# Altium project QuadcopterDesign.PrjPcb (part 2 of 4)

## Sheet [2] MicroController.SchDoc
size A4; Organization: UNMEI ELECTRICAL; Address1: 16B/12 Nguyen Du Street; Address2: Da Lat City, LD Province; SheetNumber: 2; SheetTotal: 7
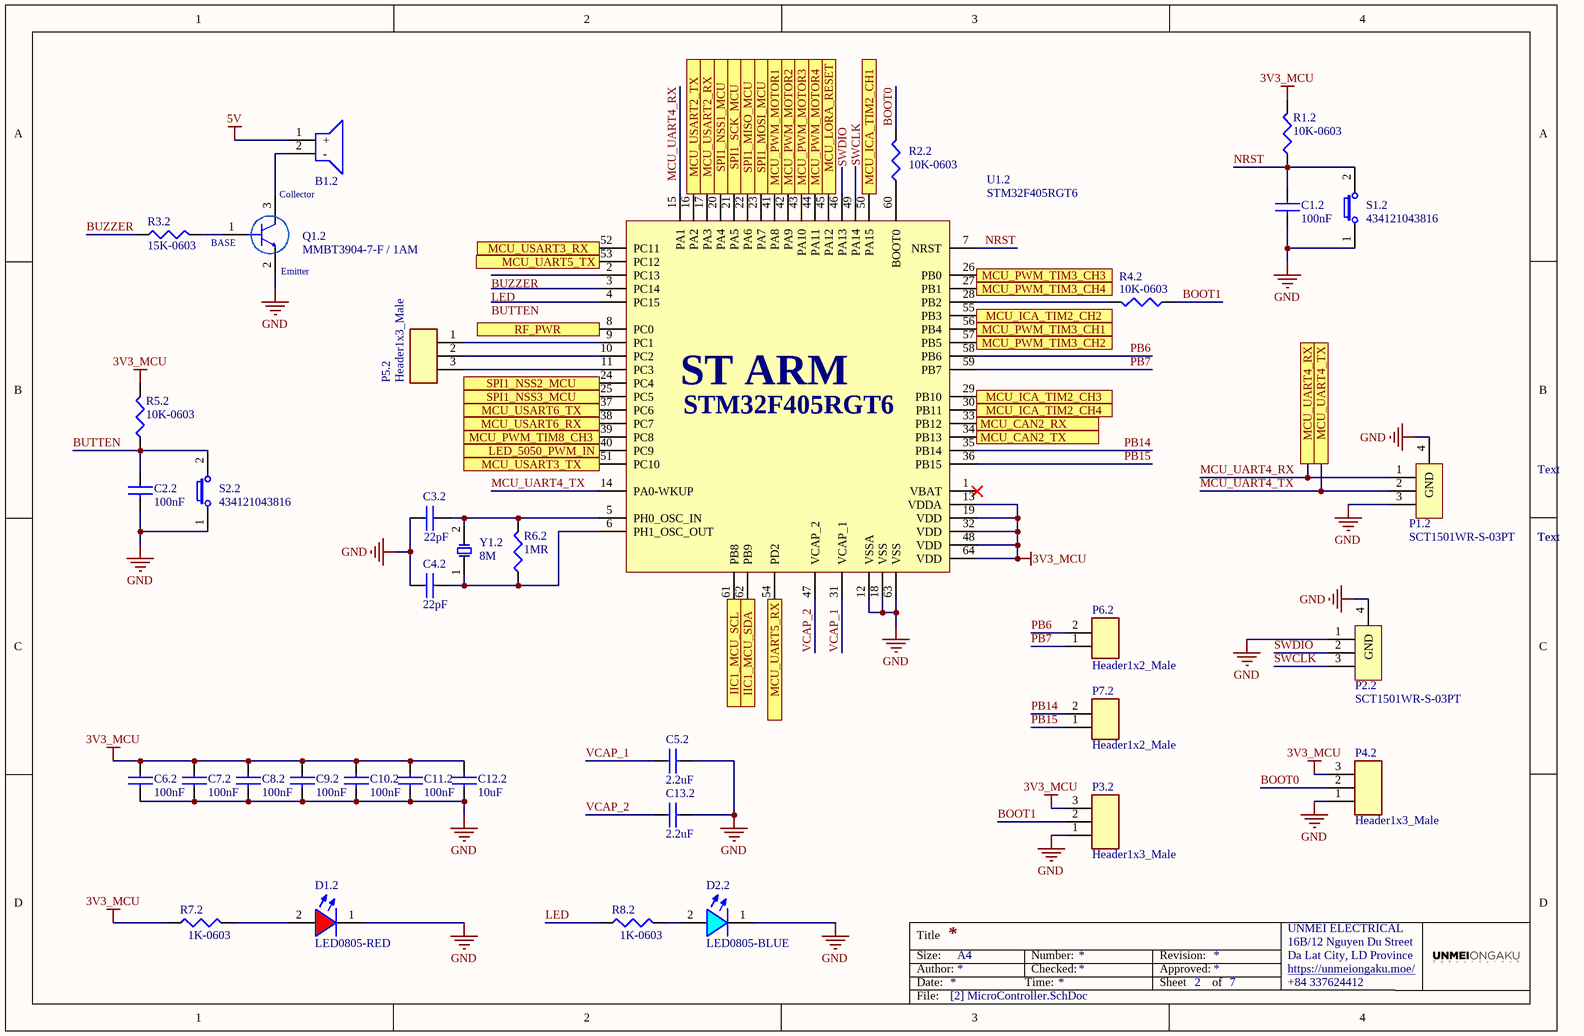
[diagram p1: [2] MicroController.SchDoc]

### Parts
B1.2  Buzzer  [Buzzer 9x5mm 60dB]  (value not drawn)
C1.2  100nF  [CAP0603]
C2.2  100nF  [CAP0603]
C3.2  22pF  [CAP0603]
C4.2  22pF  [CAP0603]
C5.2  2.2uF  [CAP0603]
C6.2  100nF  [CAP0603]
C7.2  100nF  [CAP0603]
C8.2  100nF  [CAP0603]
C9.2  100nF  [CAP0603]
C10.2  100nF  [CAP0603]
C11.2  100nF  [CAP0603]
C12.2  10uF  [CAP0603]
C13.2  2.2uF  [CAP0603]
D1.2  LED0805-RED  [LED0805-RED]
D2.2  LED0805-BLUE  [LED0805-BLUE]
P1.2  SCT1501WR-S-03PT  [Connector ZH1.5 3P SMD]
P2.2  SCT1501WR-S-03PT  [Connector ZH1.5 3P SMD]
P3.2  Header1x3_Male  [HDR1x3_2.54_MALE]
P4.2  Header1x3_Male  [HDR1x3_2.54_MALE]
P5.2  Header1x3_Male  [HDR1x3_2.54_MALE]
P6.2  Header1x2_Male  [HDR1x2_2.54_MALE]
P7.2  Header1x2_Male  [HDR1x2_2.54_MALE]
Q1.2  MMBT3904-7-F / 1AM  [SOT23]
R1.2  10K-0603  [RES0603 - 3D]
R2.2  10K-0603  [RES0603 - 3D]
R3.2  15K-0603  [RES0603 - 3D]
R4.2  10K-0603  [RES0603 - 3D]
R5.2  10K-0603  [RES0603 - 3D]
R6.2  1MR  [RES0603 - 3D]
R7.2  1K-0603  [RES0603 - 3D]
R8.2  1K-0603  [RES0603 - 3D]
S1.2  434121043816  [Switches-6x3.5x4.3mm]
S2.2  434121043816  [Switches-6x3.5x4.3mm]
U1.2  STM32F405RGT6  [LQFP64]
Y1.2  8M  [HC49-S]

### Ports
IIC1_MCU_SCL, IIC1_MCU_SDA, LED_5050_PWM_IN, MCU_CAN2_RX, MCU_CAN2_TX, MCU_ICA_TIM2_CH1, MCU_ICA_TIM2_CH2, MCU_ICA_TIM2_CH3, MCU_ICA_TIM2_CH4, MCU_LORA_RESET, MCU_PWM_MOTOR1, MCU_PWM_MOTOR2, MCU_PWM_MOTOR3, MCU_PWM_MOTOR4, MCU_PWM_TIM3_CH1, MCU_PWM_TIM3_CH2, MCU_PWM_TIM3_CH3, MCU_PWM_TIM3_CH4, MCU_PWM_TIM8_CH3, MCU_UART4_RX, MCU_UART4_TX, MCU_UART5_RX, MCU_UART5_TX, MCU_USART2_RX, MCU_USART2_TX, MCU_USART3_RX, MCU_USART3_TX, MCU_USART6_RX, MCU_USART6_TX, RF_PWR, SPI1_MISO_MCU, SPI1_MOSI_MCU, SPI1_NSS1_MCU, SPI1_NSS2_MCU, SPI1_NSS3_MCU, SPI1_SCK_MCU

### Nets
3V3_MCU: C6.2.1 C7.2.1 C8.2.1 C9.2.1 C10.2.1 C11.2.1 C12.2.1 P3.2.3 P4.2.3 R1.2.2 R5.2.2 R7.2.1 U1.2.13(VDDA) U1.2.19(VDD) U1.2.32(VDD) U1.2.48(VDD) U1.2.64(VDD)  [project net 3V3_MC]
5V: B1.2.1(+)
GND: C1.2.2 C2.2.2 C3.2.1 C4.2.1 C5.2.2 C6.2.2 C7.2.2 C8.2.2 C9.2.2 C10.2.2 C11.2.2 C12.2.2 C13.2.2 D1.2.1(+) D2.2.1(+) P1.2.3 P1.2.4(GND) P2.2.1 P2.2.4(GND) P3.2.1 P4.2.1 Q1.2.2 S1.2.1 S2.2.1 U1.2.12(VSSA) U1.2.18(VSS) U1.2.63(VSS)
BOOT0: P4.2.2 R2.2.2
BOOT1: P3.2.2 R4.2.1
BUTTEN: C2.2.1 R5.2.1 S2.2.2 U1.2.4(PC15)
BUZZER: R3.2.1 U1.2.2(PC13)
LED: R8.2.1 U1.2.3(PC14)
MCU_UART4_RX: P1.2.1 U1.2.15(PA1) ; port MCU_UART4_RX
MCU_UART4_TX: P1.2.2 U1.2.14(PA0-WKUP) ; port MCU_UART4_TX
NRST: C1.2.1 R1.2.1 S1.2.2 U1.2.7(NRST)
PB6: P6.2.2 U1.2.58(PB6)
PB7: P6.2.1 U1.2.59(PB7)
PB14: P7.2.2 U1.2.35(PB14)
PB15: P7.2.1 U1.2.36(PB15)
SWCLK: P2.2.3 U1.2.49(PA14)
SWDIO: P2.2.2 U1.2.46(PA13)
VCAP_1: C5.2.1 U1.2.31(VCAP_1)
VCAP_2: C13.2.1 U1.2.47(VCAP_2)
NetB1.2_2: B1.2.2(-) Q1.2.3
NetC3.2_2: C3.2.2 R6.2.2 U1.2.5(PH0_OSC_IN) Y1.2.2
NetC4.2_2: C4.2.2 R6.2.1 U1.2.6(PH1_OSC_OUT) Y1.2.1
NetD1.2_2: D1.2.2(+) R7.2.2
NetD2.2_2: D2.2.2(+) R8.2.2
NetIC1.3_5: U1.2.62(PB9) ; port IIC1_MCU_SDA
NetIC1.3_6: U1.2.61(PB8) ; port IIC1_MCU_SCL
NetP1.6_2: U1.2.51(PC10) ; port MCU_USART3_TX
NetP1.6_3: U1.2.52(PC11) ; port MCU_USART3_RX
NetP2.5_1: U1.2.54(PD2) ; port MCU_UART5_RX
NetP2.5_2: U1.2.53(PC12) ; port MCU_UART5_TX
NetP2.6_1: U1.2.21(PA5) ; port SPI1_SCK_MCU
NetP2.6_2: U1.2.23(PA7) ; port SPI1_MOSI_MCU
NetP2.6_3: U1.2.22(PA6) ; port SPI1_MISO_MCU
NetP2.6_4: U1.2.25(PC5) ; port SPI1_NSS3_MCU
NetP3.5_1: U1.2.17(PA3) ; port MCU_USART2_RX
NetP3.5_2: U1.2.16(PA2) ; port MCU_USART2_TX
NetP4.5_1: U1.2.38(PC7) ; port MCU_USART6_RX
NetP4.5_2: U1.2.37(PC6) ; port MCU_USART6_TX
NetP5.2_1: P5.2.1 U1.2.9(PC1)
NetP5.2_2: P5.2.2 U1.2.10(PC2)
NetP5.2_3: P5.2.3 U1.2.11(PC3)
NetP5.5_1: U1.2.20(PA4) ; port SPI1_NSS1_MCU
NetP6.3_1: U1.2.50(PA15) ; port MCU_ICA_TIM2_CH1
NetP6.3_2: U1.2.55(PB3) ; port MCU_ICA_TIM2_CH2
NetP6.3_3: U1.2.29(PB10) ; port MCU_ICA_TIM2_CH3
NetP6.3_4: U1.2.30(PB11) ; port MCU_ICA_TIM2_CH4
NetP6.5_1: U1.2.33(PB12) ; port MCU_CAN2_RX
NetP6.5_2: U1.2.34(PB13) ; port MCU_CAN2_TX
NetP11.7_2: U1.2.39(PC8) ; port MCU_PWM_TIM8_CH3
NetQ1.2_1: Q1.2.1 R3.2.2
NetR1.5_2: U1.2.40(PC9) ; port LED_5050_PWM_IN
NetR2.2_1: R2.2.1 U1.2.60(BOOT0)
NetR2.6_1: U1.2.8(PC0) ; port RF_PWR
NetR4.2_2: R4.2.2 U1.2.28(PB2)
NetRF1.6_4: U1.2.45(PA12) ; port MCU_LORA_RESET
NetRF1.6_15: U1.2.24(PC4) ; port SPI1_NSS2_MCU
NetU1.2_26: U1.2.26(PB0) ; port MCU_PWM_TIM3_CH3
NetU1.2_27: U1.2.27(PB1) ; port MCU_PWM_TIM3_CH4
NetU1.2_41: U1.2.41(PA8) ; port MCU_PWM_MOTOR1
NetU1.2_42: U1.2.42(PA9) ; port MCU_PWM_MOTOR2
NetU1.2_43: U1.2.43(PA10) ; port MCU_PWM_MOTOR3
NetU1.2_44: U1.2.44(PA11) ; port MCU_PWM_MOTOR4
NetU1.2_56: U1.2.56(PB4) ; port MCU_PWM_TIM3_CH1
NetU1.2_57: U1.2.57(PB5) ; port MCU_PWM_TIM3_CH2

Not connected (* = marked no-connect by the designer): U1.2 1(VBAT)*

### Notes on the sheet
- Text
- Title
- Size:
- Date:
- Author:
- A4
- Time:
- Number:
- Checked:
- Revision:
- Sheet
- Approved:
- of
- https://unmeiongaku.moe/
- +84 337624412
- File:
- (in symbol MMBT3904-7-F / 1AM) Collector; BASE; Emitter
- (in symbol STM32F405RGT6) ST ARM

### Library data of the parts
B1.2 = Buzzer 9050 - DIP: 9050 DIP Buzzer 9x5mm 60dB; Local Supplier: thegioiic; Local Supplier Link: https://www.thegioiic.com/products/1209-dip-buzzer-12x9mm; Local Supplier Part Number: 1209 DIP Buzzer 12x9mm
C1.2 C2.2 C6.2 C7.2 C8.2 C9.2 C10.2 C11.2 = CC0603KRX7R9BB104: CAP CER 0.1UF 50V X7R 0603; Manufacturer 1: Yageo; Category 1: Capacitors; Capacitance: 0.1µF; Tolerance: ±10%; Supplier 1: Digi-Key; Supplier Part Number 1: 311-1344-1-ND; Manufacturer Part Number 1: CC0603KRX7R9BB104; RoHS 1: RoHS Compliant; Description 1: CAP CER 0.1UF 50V X7R 0603; Stock 1: 4411645; Pricing 1: 1=0.1, 10=0.031, 100=0.014, 500=0.00998, 1000=0.00783 (USD); Packaging: Cut Tape (CT); Part Status: Active; Voltage - Rated: 50V; Temperature Coefficient: X7R; Operating Temperature: -55°C ~ 125°C; Features: -; Ratings: -; Applications: General Purpose; Failure Rate: -; Mounting Type: Surface Mount, MLCC; Package / Case: 0603 (1608 Metric); Size / Dimension: 0.063" L x 0.031" W (1.60mm x 0.80mm); Height - Seated (Max): -; Thickness (Max): 0.035" (0.90mm); Lead Spacing: -; Lead Style: -; ComponentLink1URL: http://www.yageo.com/documents/recent/UPY-GPHC_X7R_6.3V-to-50V_18.pdf; ComponentLink1Description: http://www.yageo.com/documents/recent/UPY-GPHC_X7R_6.3V-to-50V_18.pdf; Value: 100nF
C3.2 C4.2 = CC0603JRNPO9BN220: Surface Mount Ceramic Multilayer Capacitor 22pF 5% C0G 50V 0603 Paper T/R; Manufacturer: Yageo; Insulation Resistance: 10GR; Temperature Coefficient: 30ppm/°C; Supplier 1: Newark; Manufacturer Part Number: CC0603JRNPO9BN220; RoHS: Yes; Category: Ceramic Capacitors; Stock 1: 70605; Pricing 1: 1=0.10000, 10=0.02100, 25=0.02000, 50=0.01900, 100=0.01800 (USD); Mount: Surface Mount; Case/Package: 0603; Number of Pins: 2; Case Code (Imperial): 0603; Case Code (Metric): 1608; Min Operating Temperature: -55°C; Max Operating Temperature: 125°C; Capacitance: 22pF; Tolerance: 5%; Voltage Rating: 50V; Packaging: Tape and Reel; Dielectric: C0G; Termination: SMD/SMT; Series: CC; Voltage Rating (DC): 50V; Package Quantity: 1; Voltage: 50V; Length: 1.6mm; Width: 0.031inch; Height: 0.8mm; Thickness: 0.035inch; Depth: 0.8mm; Radiation Hardening: No; Lead Free: Lead Free; RoHS Compliant: Yes; Reach SVHC Compliant: Yes; Supplier Part Number 1: 46WX087
C5.2 C13.2 = CC0603KRX7R6BB225: CAP CER 2.2UF 10V X7R 0603; Manufacturer 1: Yageo; Category 1: Capacitors; Capacitance: 2.2µF; Tolerance: ±10%; Supplier 1: Digi-Key; Supplier Part Number 1: 311-1797-1-ND; Manufacturer Part Number 1: CC0603KRX7R6BB225; RoHS 1: RoHS Compliant; Description 1: CAP CER 2.2UF 10V X7R 0603; Stock 1: 14291; Pricing 1: 1=0.32, 10=0.219, 100=0.1238, 500=0.0874, 1000=0.07648 (USD); Packaging: Cut Tape (CT); Part Status: Active; Voltage - Rated: 10V; Temperature Coefficient: X7R; Operating Temperature: -55°C ~ 125°C; Features: -; Ratings: -; Applications: General Purpose; Failure Rate: -; Mounting Type: Surface Mount, MLCC; Package / Case: 0603 (1608 Metric); Size / Dimension: 0.063" L x 0.031" W (1.60mm x 0.80mm); Height - Seated (Max): -; Thickness (Max): 0.035" (0.90mm); Lead Spacing: -; Lead Style: -; ComponentLink1URL: http://www.yageo.com/documents/recent/UPY-GPHC_X7R_6.3V-to-50V_18.pdf; ComponentLink1Description: http://www.yageo.com/documents/recent/UPY-GPHC_X7R_6.3V-to-50V_18.pdf; Value: 2.2uF
C12.2 = CC0603KRX5R6BB106: CAP CER 10UF 10V X5R 0603; Manufacturer 1: Yageo; Category 1: Capacitors; Capacitance: 10µF; Tolerance: ±10%; Supplier 1: Digi-Key; Supplier Part Number 1: 311-1782-1-ND; Manufacturer Part Number 1: CC0603KRX5R6BB106; RoHS 1: RoHS Compliant; Description 1: CAP CER 10UF 10V X5R 0603; Stock 1: 66566; Pricing 1: 1=0.33, 10=0.225, 100=0.1272, 500=0.08982, 1000=0.07858 (USD); Packaging: Cut Tape (CT); Part Status: Active; Voltage - Rated: 10V; Temperature Coefficient: X5R; Operating Temperature: -55°C ~ 85°C; Features: -; Ratings: -; Applications: General Purpose; Failure Rate: -; Mounting Type: Surface Mount, MLCC; Package / Case: 0603 (1608 Metric); Size / Dimension: 0.063" L x 0.031" W (1.60mm x 0.80mm); Height - Seated (Max): -; Thickness (Max): 0.035" (0.90mm); Lead Spacing: -; Lead Style: -; ComponentLink1URL: http://www.yageo.com/documents/recent/UPY-GPHC_X5R_4V-to-50V_24.pdf; ComponentLink1Description: http://www.yageo.com/documents/recent/UPY-GPHC_X5R_4V-to-50V_24.pdf; Value: 10uF
P3.2 P4.2 P5.2 = HDR1x3_2.54_MALE: Header1x3_2.54_MALE
P6.2 P7.2 = HDR1x2_2.54_MALE: Header1x2_2.54_MALE
Q1.2 = MMBT3904-7-F / 1AM: Transistor General Purpose BJT NPN 40 Volt 0.2A Automotive 3-Pin SOT-23; Manufacturer: Diodes Zetex; Collector Emitter Breakdown Voltage: 40V; Max Power Dissipation: 300mW; Max Collector Current: 200mA; Transition Frequency: 300MHz; Collector Base Voltage (VCBO): 60V; Emitter Base Voltage (VEBO): 6V; Collector Emitter Saturation Voltage: 300mV; Element Configuration: Single; hFE Min: 100; Power Dissipation: 350mW; Number of Elements: 1; Supplier 1: Digi-Key; Manufacturer Part Number: MMBT3904-7-F; RoHS: Yes; Category: BJTs; Stock 1: 468030; Pricing 1: 3000=0.02271, 6000=0.02048, 15000=0.01781, 30000=0.01603, 75000=0.01425 (USD); Mount: Surface Mount; Case/Package: SOT-23; Number of Pins: 3; Contact Plating: Tin,Matte; Weight: 0.000282oz; Min Operating Temperature: -55°C; Max Operating Temperature: 150°C; Packaging: Tape and Reel; Polarity: NPN; Package Quantity: 3000; Collector Emitter Voltage (VCEO): 40V; Gain Bandwidth Product: 300MHz; Frequency: 300MHz; Max Breakdown Voltage: 40V; Series: -; Collector-emitter Voltage-Max: 300mV; Voltage Rating (DC): 40V; Max Frequency: 300MHz; Continuous Collector Current: 200mA; Length: 3.05mm; Width: 1.4mm; Height: 1mm; Radiation Hardening: No; RoHS Compliant: Yes; Lead Free: Lead Free; REACH SVHC: No SVHC; ComponentLink1URL: https://datasheet.ciiva.com/11201/ds30036-11201778.pdf?src-supplier=Avnet; ComponentLink1Description: https://datasheet.ciiva.com/11201/ds30036-11201778.pdf?src-supplier=Avnet; ComponentLink2URL: https://datasheet.ciiva.com/15138/getdatasheetpartid-53265-15138780.pdf?src-supplier=Verical; ComponentLink2Description: https://datasheet.ciiva.com/15138/getdatasheetpartid-53265-15138780.pdf?src-supplier=Verical; ComponentLink3URL: https://datasheet.ciiva.com/22711/1915516-22711750.pdf?src-supplier=Element14; ComponentLink3Description: https://datasheet.ciiva.com/22711/1915516-22711750.pdf?src-supplier=Element14; ComponentLink4URL: https://datasheet.ciiva.com/11198/ds30036-11198999.pdf?src-supplier=Avnet; ComponentLink4Description: https://datasheet.ciiva.com/11198/ds30036-11198999.pdf?src-supplier=Avnet; ComponentLink5URL: https://datasheet.ciiva.com/6361/ds30036-6361256.pdf?src-supplier=Digi-Key; ComponentLink5Description: https://datasheet.ciiva.com/6361/ds30036-6361256.pdf?src-supplier=Digi-Key; ComponentLink6URL: https://datasheet.ciiva.com/6361/ds30036-6361254.pdf?src-supplier=Digi-Key; ComponentLink6Description: https://datasheet.ciiva.com/6361/ds30036-6361254.pdf?src-supplier=Digi-Key; Supplier Part Number 1: MMBT3904-FDITR-ND
R1.2 R2.2 R4.2 R5.2 = RC0603FR-0710KL: RES SMD 10K OHM 1% 1/10W 0603; Manufacturer: Yageo; Power (Watts): 0.1W, 1/10W; Temperature Coefficient: ±100ppm/°C; Supplier 1: Digi-Key; Manufacturer Part Number: RC0603FR-0710KL; RoHS: RoHS Compliant; Category: Resistors; Stock 1: 16545228; Pricing 1: 1=0.1, 10=0.015, 100=0.006, 1000=0.00268, 2500=0.00233 (USD); Packaging: Cut Tape (CT); Part Status: Active; Composition: Thick Film; Features: Moisture Resistant; Operating Temperature: -55°C ~ 155°C; Package / Case: 0603 (1608 Metric); Supplier Device Package: 0603; Size / Dimension: 0.063" L x 0.032" W (1.60mm x 0.80mm); Height - Seated (Max): 0.022" (0.55mm); Failure Rate: -; ComponentLink1URL: http://www.yageo.com/documents/recent/PYu-RC_Group_51_RoHS_L_7.pdf; ComponentLink1Description: http://www.yageo.com/documents/recent/PYu-RC_Group_51_RoHS_L_7.pdf; Supplier Part Number 1: 311-10.0KHRCT-ND; Value: 10K; Tolerance: ±1%
R3.2 = RC0603JR-0715KL: Thick Film Resistors - SMD 15K OHM 5%; Manufacturer: Yageo; Power Rating: 100 mW, 200 mW; Resistance: 15 kOhms; Temperature Coefficient: 100 PPM / C; Voltage Rating: 75 V; Supplier 1: Mouser; Manufacturer Part Number: RC0603JR-0715KL; RoHS: RoHS Compliant; Category: Thick Film Resistors - SMD; Stock 1: 39889; Pricing 1: 1=0.100, 10=0.015, 100=0.005, 1000=0.004, 5000=0.004 (USD); Application: High Reliability; Features: -; Height: 0.45 mm; Length: 1.6 mm; Package / Case: 0603 (1608 metric); Packaging: Cut Tape; Product: Thick Film Resistors SMD; Series: RC; Technology: Thick Film; Termination Style: SMD/SMT; Tolerance: 5 %; Type: General Purpose; Width: 0.8 mm; Brand: Yageo; Mounting Style: PCB Mount; Case Code - in: 0603; Case Code - mm: 1608; Maximum Operating Temperature: + 155 C; Minimum Operating Temperature: - 55 C; Product Type: Thick Film Resistors; Standard Pack Qty: 5000; Subcategory: Resistors; RoHS - Mouser: Y; Minimum Order Quantity: 1; Reeling: True; ComponentLink1URL: http://www.mouser.com/datasheet/2/447/PYu-RC_Group_51_RoHS_L_9-1314892.pdf; ComponentLink1Description: http://www.mouser.com/datasheet/2/447/PYu-RC_Group_51_RoHS_L_9-1314892.pdf; Supplier Part Number 1: 603-RC0603JR-0715KL; Value: 15K
R6.2 = RC0603JR-071ML: RES SMD 1M OHM 5% 1/10W 0603; Manufacturer 1: Yageo; Category 1: Resistors; Power (Watts): 0.1W, 1/10W; Temperature Coefficient: ±100ppm/°C; Supplier 1: Digi-Key; Supplier Part Number 1: 311-1.0MGRCT-ND; Manufacturer Part Number 1: RC0603JR-071ML; RoHS 1: RoHS Compliant; Description 1: RES SMD 1M OHM 5% 1/10W 0603; Stock 1: 1727458; Pricing 1: 1=0.1, 10=0.011, 100=0.0044, 1000=0.00198, 2500=0.00172 (USD); Packaging: Cut Tape (CT); Part Status: Active; Resistance (Ohms): 1M; Tolerance: ±5%; Composition: Thick Film; Features: Moisture Resistant; Operating Temperature: -55°C ~ 155°C; Package / Case: 0603 (1608 Metric); Supplier Device Package: 0603; Size / Dimension: 0.063" L x 0.031" W (1.60mm x 0.80mm); Height - Seated (Max): 0.022" (0.55mm); Failure Rate: -; ComponentLink1URL: http://www.yageo.com/documents/recent/PYu-RC_Group_51_RoHS_L_7.pdf; ComponentLink1Description: http://www.yageo.com/documents/recent/PYu-RC_Group_51_RoHS_L_7.pdf; Value: 1M
R7.2 R8.2 = RC0603JR-071KL: RES SMD 1K OHM 5% 1/10W 0603; Manufacturer 1: Yageo; Category 1: Resistors; Power (Watts): 0.1W, 1/10W; Temperature Coefficient: ±100ppm/°C; Supplier 1: Digi-Key; Supplier Part Number 1: 311-1.0KGRCT-ND; Manufacturer Part Number 1: RC0603JR-071KL; RoHS 1: RoHS Compliant; Description 1: RES SMD 1K OHM 5% 1/10W 0603; Stock 1: 2853955; Pricing 1: 1=0.1, 10=0.011, 100=0.0044, 1000=0.00198, 2500=0.00172 (USD); Packaging: Cut Tape (CT); Part Status: Active; Resistance (Ohms): 1k; Tolerance: ±5%; Composition: Thick Film; Features: Moisture Resistant; Operating Temperature: -55°C ~ 155°C; Package / Case: 0603 (1608 Metric); Supplier Device Package: 0603; Size / Dimension: 0.063" L x 0.031" W (1.60mm x 0.80mm); Height - Seated (Max): 0.022" (0.55mm); Failure Rate: -; ComponentLink1URL: http://www.yageo.com/documents/recent/PYu-RC_Group_51_RoHS_L_7.pdf; ComponentLink1Description: http://www.yageo.com/documents/recent/PYu-RC_Group_51_RoHS_L_7.pdf; Value: 1K
S1.2 S2.2 = 434121043816: Switch Tactile Spst-no 0.05A 12V; Manufacturer: Wurth Electronics; Mechanical Life: 50000Cycles; Actuator Material: Polymer,Liquid Crystal Polymer; Contact Current Rating: 50mA; Operating Force: 160gf; Illumination Type: Non-Illuminated,Illuminated; Throw Configuration: SPST; Insulation Resistance: 100MR; Switch Travel: 0.25mm; Switch Function: Off-Mom; Actuator Length: 0.8mm; Supplier 1: RSComponents; Manufacturer Part Number: 434121043816; RoHS: Yes; Category: Tactile Switches; Stock 1: 337; Pricing 1: 1=1.69500 (USD); Mount: Surface Mount; Contact Material: Stainless Steel,Steel; Min Operating Temperature: -40°C; Max Operating Temperature: 85°C; Current Rating: 50mA; Packaging: Tape and Reel; Termination: SMD/SMT; Series: WS-TASV; Contact Type: 1 maker; Length: 8mm; Width: 3.5mm; Height: 4.3mm; REACH SVHC: No SVHC; RoHS Compliant: Yes; ComponentLink1URL: https://datasheet.ciiva.com/30466/0900766b8126b631-30466746.pdf?src-supplier=RSComponents; ComponentLink1Description: https://datasheet.ciiva.com/30466/0900766b8126b631-30466746.pdf?src-supplier=RSComponents; ComponentLink2URL: https://datasheet.ciiva.com/29123/711754-da-01-en-taster-434121043816-29123819.pdf?src-supplier=Conrad; ComponentLink2Description: https://datasheet.ciiva.com/29123/711754-da-01-en-taster-434121043816-29123819.pdf?src-supplier=Conrad; ComponentLink3URL: https://datasheet.ciiva.com/1532/434121043816-1532524.pdf?src-supplier=Element14; ComponentLink3Description: https://datasheet.ciiva.com/1532/434121043816-1532524.pdf?src-supplier=Element14; ComponentLink4URL: https://datasheet.ciiva.com/1633/434121043816-1633934.pdf?src-supplier=Farnell; ComponentLink4Description: https://datasheet.ciiva.com/1633/434121043816-1633934.pdf?src-supplier=Farnell; Supplier Part Number 1: 7856421
U1.2 = STM32F405RGT6: IC MCU 32BIT 1MB FLASH 64LQFP; Manufacturer: STMicroelectronics; Core Architecture: ARM; Interface: I2C,SPI,USB,CAN,IrDA,UART,USART,LIN,I2S; Data Bus Width: 32b; Frequency: 168MHz; RAM Size: 196KB; Number of I/Os: 51; Max Supply Voltage: 3.6V; Min Supply Voltage: 1.8V; Memory Size: 1024KB; Number of Timers/Counters: 14; Number of ADC Channels: 16; Oscillator Type: Internal; Number of SPI Channels: 3; Peripherals: Brown-out Detect/Reset,POR,PWM,WDT,DMA,LCD,I2C; Number of PWM Channels: 2; Watchdog Timer: Yes; Supplier 1: Newark; Manufacturer Part Number: STM32F405RGT6; RoHS: Yes; Category: Microcontrollers; Pricing 1: 1=16.96000, 10=15.60000, 25=14.94000, 50=14.35000, 100=13.76000, 250=13.17000, 500=11.78000 (USD); Case/Package: LQFP; Number of Pins: 64; Min Operating Temperature: -40°C; Max Operating Temperature: 85°C; Package Quantity: 960; Packaging: Tray; Max Frequency: 168MHz; Number of I2C Channels: 3; Memory Type: FLASH; Number of UART Channels: 2; Series: STM32 F4; Number of Programmable I/O: 51; Length: 10mm; Width: 10mm; Height: 1.45mm; Radiation Hardening: No; Reach SVHC Compliant: Yes; RoHS Compliant: Yes; Lead Free: Lead Free; ComponentLink1URL: https://datasheet.ciiva.com/8055/1717982-8055024.pdf?src-supplier=Element14; ComponentLink1Description: https://datasheet.ciiva.com/8055/1717982-8055024.pdf?src-supplier=Element14; ComponentLink2URL: https://datasheet.ciiva.com/4837/dm00037051-492832-4837997.pdf?src-supplier=Mouser; ComponentLink2Description: https://datasheet.ciiva.com/4837/dm00037051-492832-4837997.pdf?src-supplier=Mouser; Supplier Part Number 1: 71T9854
Y1.2 = Crystals - HC49SSDLF-8.00MHz: Crystals LO-PRO 8MHz; Manufacturer: Fox Electronics; Supplier 1: Mouser; Manufacturer Part Number: HC49SSDLF-8.00MHz; RoHS: Yes; Category: Uncategorized; Frequency: 8MHz; Packaging: Tape and Reel; Package Quantity: 1000; Termination: SMD/SMT; Length: 13.2mm; Width: 5mm; Height: 3.2mm; ComponentLink1URL: https://datasheet.ciiva.com/12388/hc49ssdlf-16337-12388064.pdf?src-supplier=Mouser; ComponentLink1Description: https://datasheet.ciiva.com/12388/hc49ssdlf-16337-12388064.pdf?src-supplier=Mouser; Supplier Part Number 1: 559-280LF-080

## Sheet [3] Sensor.SchDoc
size A4; Organization: UNMEI ELECTRICAL; Address1: 16B/12 Nguyen Du Street; Address2: Da Lat City, LD Province; SheetNumber: 3; SheetTotal: 7
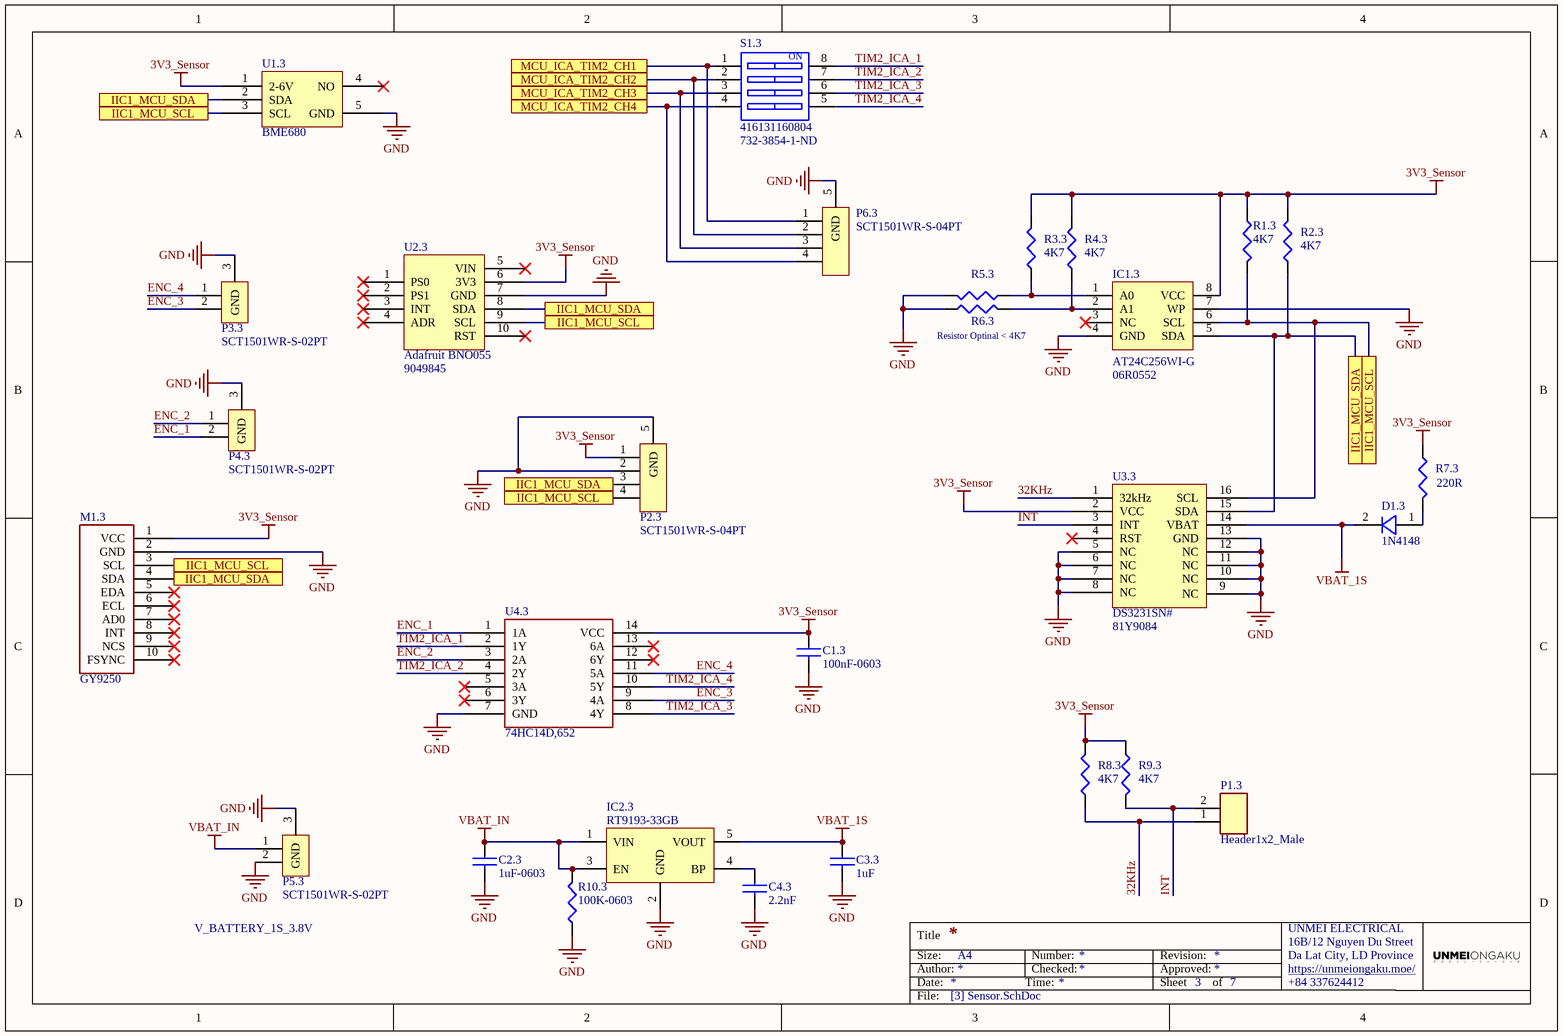
[diagram p2: [3] Sensor.SchDoc]

### Parts
C1.3  100nF-0603  [CAP0603]
C2.3  1uF-0603  [CAP0603]
C3.3  1uF  [CAP0603]
C4.3  2.2nF  [CAP0603]
D1.3  1N4148  [SOD-80]
IC1.3  AT24C256WI-G  Supplier Part Number 1: 06R0552  [SOP8]
IC2.3  RT9193-33GB  [SOT23-5]
M1.3  GY9250  [GY9250]
P1.3  Header1x2_Male  [HDR1x2_2.54_MALE]
P2.3  SCT1501WR-S-04PT  [Connector ZH1.5 4P SMD]
P3.3  SCT1501WR-S-02PT  [Connector ZH1.5 2P SMD]
P4.3  SCT1501WR-S-02PT  [Connector ZH1.5 2P SMD]
P5.3  SCT1501WR-S-02PT  [Connector ZH1.5 2P SMD]
P6.3  SCT1501WR-S-04PT  [Connector ZH1.5 4P SMD]
R1.3  4K7  [RES0603 - 3D]
R2.3  4K7  [RES0603 - 3D]
R3.3  4K7  [RES0603 - 3D]
R4.3  4K7  [RES0603 - 3D]
R5.3  70R  [RES0805]  (value not drawn)
R6.3  70R  [RES0805]  (value not drawn)
R7.3  220R  [RES0603 - 3D]
R8.3  4K7  [RES0603 - 3D]
R9.3  4K7  [RES0603 - 3D]
R10.3  100K-0603  [RES0603 - 3D]
S1.3  416131160804  Supplier Part Number 1: 732-3854-1-ND  [DIP Switches SMD 1.27mm 4P]
U1.3  BME680  [BME680]
U2.3  Adafruit BNO055  Supplier Part Number 1: 9049845  [Adafruit BNO055]
U3.3  DS3231SN#  Supplier Part Number 1: 81Y9084  [SOIC-16W]
U4.3  74HC14D,652  [SOT108-1_NEX]

### Ports
IIC1_MCU_SCL, IIC1_MCU_SDA, MCU_ICA_TIM2_CH1, MCU_ICA_TIM2_CH2, MCU_ICA_TIM2_CH3, MCU_ICA_TIM2_CH4

### Nets
3V3_Sensor: C1.3.1 IC1.3.8(VCC) M1.3.1(VCC) P2.3.1 R1.3.1 R2.3.2 R3.3.2 R4.3.2 R7.3.1 R8.3.2 R9.3.1 U1.3.1(2-6V) U2.3.6(3V3) U3.3.2(VCC) U4.3.14(VCC)
GND: C1.3.2 C2.3.2 C3.3.2 C4.3.2 IC1.3.4(GND) IC1.3.7(WP) IC2.3.2(GND) M1.3.2(GND) P2.3.2 P2.3.5(GND) P3.3.3(GND) P4.3.3(GND) P5.3.2 P5.3.3(GND) P6.3.5(GND) R5.3.2 R6.3.1 R10.3.1 U1.3.5(GND) U2.3.7(GND) U3.3.5(NC) U3.3.6(NC) U3.3.7(NC) U3.3.8(NC) U3.3.9(NC) U3.3.10(NC) U3.3.11(NC) U3.3.12(NC) U3.3.13(GND) U4.3.7(GND)
VBAT_1S: C3.3.1 D1.3.2(Cathode) IC2.3.5(VOUT) U3.3.14(VBAT)
VBAT_IN: C2.3.1 IC2.3.1(VIN) IC2.3.3(EN) P5.3.1 R10.3.2
32KHz: P1.3.1 R8.3.1 U3.3.1(32kHz)
ENC_1: P4.3.2 U4.3.1(1A)
ENC_2: P4.3.1 U4.3.3(2A)
ENC_3: P3.3.2 U4.3.9(4A)
ENC_4: P3.3.1 U4.3.11(5A)
INT: P1.3.2 R9.3.2 U3.3.3(INT)
TIM2_ICA_1: S1.3.8 U4.3.2(1Y)
TIM2_ICA_2: S1.3.7 U4.3.4(2Y)
TIM2_ICA_3: S1.3.6 U4.3.8(4Y)
TIM2_ICA_4: S1.3.5 U4.3.10(5Y)
NetC4.3_1: C4.3.1 IC2.3.4(BP)
NetD1.3_1: D1.3.1(Anode) R7.3.2
NetIC1.3_1: IC1.3.1(A0) R3.3.1 R5.3.1
NetIC1.3_2: IC1.3.2(A1) R4.3.1 R6.3.2
NetIC1.3_5: IC1.3.5(SDA) M1.3.4(SDA) P2.3.3 R2.3.1 U1.3.2(SDA) U2.3.8(SDA) U3.3.15(SDA) ; port IIC1_MCU_SDA
NetIC1.3_6: IC1.3.6(SCL) M1.3.3(SCL) P2.3.4 R1.3.2 U1.3.3(SCL) U2.3.9(SCL) U3.3.16(SCL) ; port IIC1_MCU_SCL
NetP6.3_1: P6.3.1 S1.3.1 ; port MCU_ICA_TIM2_CH1
NetP6.3_2: P6.3.2 S1.3.2 ; port MCU_ICA_TIM2_CH2
NetP6.3_3: P6.3.3 S1.3.3 ; port MCU_ICA_TIM2_CH3
NetP6.3_4: P6.3.4 S1.3.4 ; port MCU_ICA_TIM2_CH4

Not connected (* = marked no-connect by the designer): IC1.3 3(NC)*; M1.3 5(EDA)* 6(ECL)* 7(AD0)* 8(INT)* 9(NCS)* 10(FSYNC)*; U1.3 4(NO)*; U2.3 1(PS0)* 2(PS1)* 3(INT)* 4(ADR)* 5(VIN)* 10(RST)*; U3.3 4(RST)*; U4.3 5(3A)* 6(3Y)* 12(6Y)* 13(6A)*

### Notes on the sheet
- Resistor Optinal < 4K7
- V_BATTERY_1S_3.8V
- Title
- Size:
- Date:
- Author:
- A4
- Time:
- Number:
- Checked:
- Revision:
- Sheet
- Approved:
- of
- https://unmeiongaku.moe/
- +84 337624412
- File:
- (in symbol 416131160804) ON

### Library data of the parts
C1.3 = CC0603KRX7R9BB104: CAP CER 0.1UF 50V X7R 0603; Manufacturer 1: Yageo; Category 1: Capacitors; Capacitance: 0.1µF; Tolerance: ±10%; Value: 100nF; Supplier 1: Digi-Key; Supplier Part Number 1: 311-1344-1-ND; Manufacturer Part Number 1: CC0603KRX7R9BB104; RoHS 1: RoHS Compliant; Description 1: CAP CER 0.1UF 50V X7R 0603; Stock 1: 4411645; Pricing 1: 1=0.1, 10=0.031, 100=0.014, 500=0.00998, 1000=0.00783 (USD); Packaging: Cut Tape (CT); Part Status: Active; Voltage - Rated: 50V; Temperature Coefficient: X7R; Operating Temperature: -55°C ~ 125°C; Features: -; Ratings: -; Applications: General Purpose; Failure Rate: -; Mounting Type: Surface Mount, MLCC; Package / Case: 0603 (1608 Metric); Size / Dimension: 0.063" L x 0.031" W (1.60mm x 0.80mm); Height - Seated (Max): -; Thickness (Max): 0.035" (0.90mm); Lead Spacing: -; Lead Style: -; ComponentLink1URL: http://www.yageo.com/documents/recent/UPY-GPHC_X7R_6.3V-to-50V_18.pdf; ComponentLink1Description: http://www.yageo.com/documents/recent/UPY-GPHC_X7R_6.3V-to-50V_18.pdf
C2.3 C3.3 = CC0603KRX7R7BB105: CAP CER 1UF 16V X7R 0603; Manufacturer 1: Yageo; Category 1: Capacitors; Capacitance: 1µF; Tolerance: ±10%; Supplier 1: Digi-Key; Supplier Part Number 1: 311-1446-1-ND; Manufacturer Part Number 1: CC0603KRX7R7BB105; RoHS 1: RoHS Compliant; Description 1: CAP CER 1UF 16V X7R 0603; Stock 1: 274580; Pricing 1: 1=0.1, 10=0.051, 100=0.0227, 500=0.0162, 1000=0.01274 (USD); Packaging: Cut Tape (CT); Part Status: Active; Voltage - Rated: 16V; Temperature Coefficient: X7R; Operating Temperature: -55°C ~ 125°C; Features: -; Ratings: -; Applications: General Purpose; Failure Rate: -; Mounting Type: Surface Mount, MLCC; Package / Case: 0603 (1608 Metric); Size / Dimension: 0.063" L x 0.031" W (1.60mm x 0.80mm); Height - Seated (Max): -; Thickness (Max): 0.035" (0.90mm); Lead Spacing: -; Lead Style: -; ComponentLink1URL: http://www.yageo.com/documents/recent/UPY-GPHC_X7R_6.3V-to-50V_18.pdf; ComponentLink1Description: http://www.yageo.com/documents/recent/UPY-GPHC_X7R_6.3V-to-50V_18.pdf; Value: 1uF
C4.3 = CC0603KRX7R9BB222: Multilayer Ceramic Capacitors MLCC - SMD/SMT 2200PF 50V 10% 0603; Manufacturer: Yageo; Type: General Purpose and High Capacitance Surface Mount Ceramic Multilayer Capacitor; Voltage Rating DC: 50 VDC; Capacitance - uF: 0.0022 uF; Class: Class 2; Dielectric: X7R; Supplier 1: Mouser; Manufacturer Part Number: CC0603KRX7R9BB222; RoHS: RoHS Compliant; Category: Multilayer Ceramic Capacitors MLCC - SMD/SMT; Stock 1: 167669; Pricing 1: 1=0.100, 10=0.090, 100=0.070, 1000=0.065, 4000=0.010, 8000=0.009 (USD); Capacitance: 2200 pF; Height: 0.8 mm; Length: 1.6 mm; Package / Case: 0603 (1608 metric); Packaging: Cut Tape; Product: General Type MLCCs; Series: CC; Termination Style: SMD/SMT; Tolerance: 10 %; Brand: Yageo; Capacitance - nF: 2.2 nF; Case Code - in: 0603; Case Code - mm: 1608; Maximum Operating Temperature: + 125 C; Minimum Operating Temperature: - 55 C; Product Type: Ceramic Capacitors; Standard Pack Qty: 4000; Subcategory: Capacitors; Termination: Standard; RoHS - Mouser: Y; Minimum Order Quantity: 1; Reeling: True; ComponentLink1URL: https://www.mouser.com/datasheet/2/447/UPY-GPHC_X7R_6.3V-to-50V_18-1154002.pdf; ComponentLink1Description: https://www.mouser.com/datasheet/2/447/UPY-GPHC_X7R_6.3V-to-50V_18-1154002.pdf; Supplier Part Number 1: 603-C0603KRX7R9BB222; Width: 0.8 mm; Value: 2.2nF
D1.3 = 1N4148: Rectifier Diode Small Signal Switching 100V 0.2A 4ns Automotive 2-Pin DO-35 Ammo; Manufacturer: NTE Electronics; Forward Voltage: 1V; Element Configuration: Single; Max Repetitive Reverse Voltage (Vrrm): 75V; Forward Current: 300mA; Current Rating: 200mA; Polarity: Standard; Capacitance: 4pF; Max Forward Surge Current (Ifsm): 1A; Power Dissipation: 500mW; Supplier 1: Allied Electronics; Manufacturer Part Number: 1N4148; RoHS: Yes; Category: Rectifier Diodes; Stock 1: 5690; Pricing 1: 1=0.08800 (USD); Mount: Through Hole; Case/Package: DO-35; Number of Pins: 2; Min Operating Temperature: -65°C; Max Operating Temperature: 175°C; Packaging: Tape and Reel; Reverse Recovery Time: 4ns; Voltage Rating (DC): 100V; Output Current: 200mA; Diameter: 2mm; Length: 4mm; RoHS Compliant: Yes; Lead Free: Lead Free; ComponentLink1URL: https://datasheet.ciiva.com/7624/1n4148-4448-7624426.pdf?src-supplier=Element14; ComponentLink1Description: https://datasheet.ciiva.com/7624/1n4148-4448-7624426.pdf?src-supplier=Element14; Supplier Part Number 1: 70214727
IC1.3 = AT24C256WI-G: CAT24C256 Series 256 Kb (32K X 8)  1.8 V - 5.5 V I2C CMOS Serial EEPROM - SOIC-8; Manufacturer: ON Semiconductor; Manufacturer Part Number: CAT24C256WI-G; Frequency: 400kHz; Access Time: 500ns; Memory Size: 256Kb; Interface: I2C,Serial; Max Supply Voltage: 5.5V; Min Supply Voltage: 1.8V; Memory Type: Non-Volatile,EEPROM; Max Frequency: 100kHz; Nominal Supply Current: 3mA; Access Time-Max: 900ns; Organization: 32KX8; Write Protection: YES; Operating Supply Voltage: 5V; Write Cycle Time-Max (tWC): 5ms; Supplier 1: Newark; RoHS: Yes; Category: EEPROM; Mount: Surface Mount; Case/Package: SOIC; Number of Pins: 8; Contact Plating: Gold; Min Operating Temperature: -40°C; Max Operating Temperature: 85°C; Packaging: Rail/Tube; Package Quantity: 100; Series: -; Density: 256Kb; Supply Current: 3mA; Supply Voltage-Nom: 5.5V; Radiation Hardening: No; Lead Free: Lead Free; RoHS Compliant: Yes; Reach SVHC Compliant: Yes; ComponentLink1URL: https://datasheet.ciiva.com/1166/cat24c256-d-1166416.pdf?src-supplier=Newark; ComponentLink1Description: https://datasheet.ciiva.com/1166/cat24c256-d-1166416.pdf?src-supplier=Newark; ComponentLink2URL: https://datasheet.ciiva.com/15123/getdatasheetpartid-257691-15123320.pdf?src-supplier=Verical; ComponentLink2Description: https://datasheet.ciiva.com/15123/getdatasheetpartid-257691-15123320.pdf?src-supplier=Verical; ComponentLink3URL: https://datasheet.ciiva.com/5700/cat24c256-d-5700793.pdf?src-supplier=Farnell; ComponentLink3Description: https://datasheet.ciiva.com/5700/cat24c256-d-5700793.pdf?src-supplier=Farnell; ComponentLink4URL: https://datasheet.ciiva.com/8072/cat24c256-d-8072141.pdf?src-supplier=Element14; ComponentLink4Description: https://datasheet.ciiva.com/8072/cat24c256-d-8072141.pdf?src-supplier=Element14; ComponentLink5URL: https://datasheet.ciiva.com/4859/cat24c256-d-105771-4859399.pdf?src-supplier=Mouser; ComponentLink5Description: https://datasheet.ciiva.com/4859/cat24c256-d-105771-4859399.pdf?src-supplier=Mouser; ComponentLink6URL: https://datasheet.ciiva.com/3185/cat24c256-d-3185116.pdf?src-supplier=Avnet; ComponentLink6Description: https://datasheet.ciiva.com/3185/cat24c256-d-3185116.pdf?src-supplier=Avnet; ComponentLink7URL: https://datasheet.ciiva.com/16456/cat24c256-d-16456381.pdf?src-supplier=Future+Electronics; ComponentLink7Description: https://datasheet.ciiva.com/16456/cat24c256-d-16456381.pdf?src-supplier=Future+Electronics; ComponentLink8URL: https://datasheet.ciiva.com/1912/cat24c256-d-1912247.pdf?src-supplier=Digi-Key; ComponentLink8Description: https://datasheet.ciiva.com/1912/cat24c256-d-1912247.pdf?src-supplier=Digi-Key
IC2.3 = RT9193-33GB: IC REG LDO 3.3V 0.3A SOT23-5
P1.3 = HDR1x2_2.54_MALE: Header1x2_2.54_MALE
R1.3 R2.3 R3.3 R4.3 R8.3 R9.3 = RC0603JR-074K7L: RES SMD 4.7K OHM 5% 1/10W 0603; Manufacturer: Yageo; Power (Watts): 0.1W, 1/10W; Temperature Coefficient: ±100ppm/°C; Supplier 1: Digi-Key; Manufacturer Part Number: RC0603JR-074K7L; RoHS: RoHS Compliant; Category: Resistors; Stock 1: 4925196; Pricing 1: 1=0.1, 10=0.011, 100=0.0046, 1000=0.00207, 2500=0.0018 (USD); Packaging: Cut Tape (CT); Part Status: Active; Tolerance: ±5%; Composition: Thick Film; Features: Moisture Resistant; Operating Temperature: -55°C ~ 155°C; Package / Case: 0603 (1608 Metric); Supplier Device Package: 0603; Size / Dimension: 0.063" L x 0.032" W (1.60mm x 0.80mm); Height - Seated (Max): 0.022" (0.55mm); Failure Rate: -; ComponentLink1URL: http://www.yageo.com/documents/recent/PYu-RC_Group_51_RoHS_L_7.pdf; ComponentLink1Description: http://www.yageo.com/documents/recent/PYu-RC_Group_51_RoHS_L_7.pdf; Supplier Part Number 1: 311-4.7KGRCT-ND; Value: 4K7
R5.3 R6.3 = RC0805JR-070RP: Res Jumper Thick Film 0805 0 Ohm 5% 1/8W Molded SMD Paper T/R; Manufacturer: Yageo; Resistance: 0mR; Max Power Dissipation: 125mW; Supplier 1: Arrow Electronics; Manufacturer Part Number: RC0805JR-070RP; RoHS: Yes; Category: Chip SMD Resistors; Stock 1: 10000; Pricing 1: 5000=0.00800, 10000=0.00690, 25000=0.00590, 50000=0.00480 (USD); Case/Package: 0805; Case Code (Metric): 2012; Case Code (Imperial): 0805; Min Operating Temperature: -55°C; Max Operating Temperature: 155°C; Resistor Type: Thick Film; Packaging: Tape and Reel; Number of Terminations: 2; Features: Moisture Resistant; Length: 0.079inch; Width: 0.049inch; Height: 0.024inch; Supplier Part Number 1: RC0805JR-070RP
R7.3 = RC0603JR-07220RL: RES SMD 220 OHM 5% 1/10W 0603; Manufacturer 1: Yageo; Category 1: Resistors; Resistance (Ohms): 220; Power (Watts): 0.1W, 1/10W; Temperature Coefficient: ±100ppm/°C; Supplier 1: Digi-Key; Supplier Part Number 1: 311-220GRCT-ND; Manufacturer Part Number 1: RC0603JR-07220RL; RoHS 1: RoHS Compliant; Description 1: RES SMD 220 OHM 5% 1/10W 0603; Stock 1: 1346821; Pricing 1: 1=0.1, 10=0.011, 100=0.0044, 1000=0.00198, 2500=0.00172 (USD); Packaging: Cut Tape (CT); Part Status: Active; Tolerance: ±5%; Composition: Thick Film; Features: Moisture Resistant; Operating Temperature: -55°C ~ 155°C; Package / Case: 0603 (1608 Metric); Supplier Device Package: 0603; Size / Dimension: 0.063" L x 0.031" W (1.60mm x 0.80mm); Height - Seated (Max): 0.022" (0.55mm); Failure Rate: -; ComponentLink1URL: http://www.yageo.com/documents/recent/PYu-RC_Group_51_RoHS_L_7.pdf; ComponentLink1Description: http://www.yageo.com/documents/recent/PYu-RC_Group_51_RoHS_L_7.pdf; Value: 220R
R10.3 = RC0603JR-07100KL: RES SMD 100K OHM 5% 1/10W 0603; Manufacturer 1: Yageo; Category 1: Resistors; Power (Watts): 0.1W, 1/10W; Temperature Coefficient: ±100ppm/°C; Supplier 1: Digi-Key; Supplier Part Number 1: 311-100KGRCT-ND; Manufacturer Part Number 1: RC0603JR-07100KL; RoHS 1: RoHS Compliant; Description 1: RES SMD 100K OHM 5% 1/10W 0603; Stock 1: 3591837; Pricing 1: 1=0.1, 10=0.011, 100=0.0044, 1000=0.00198, 2500=0.00172 (USD); Packaging: Cut Tape (CT); Part Status: Active; Resistance (Ohms): 100k; Tolerance: ±5%; Composition: Thick Film; Features: Moisture Resistant; Operating Temperature: -55°C ~ 155°C; Package / Case: 0603 (1608 Metric); Supplier Device Package: 0603; Size / Dimension: 0.063" L x 0.031" W (1.60mm x 0.80mm); Height - Seated (Max): 0.022" (0.55mm); Failure Rate: -; ComponentLink1URL: http://www.yageo.com/documents/recent/PYu-RC_Group_51_RoHS_L_7.pdf; ComponentLink1Description: http://www.yageo.com/documents/recent/PYu-RC_Group_51_RoHS_L_7.pdf; Value: 100K
S1.3 = 416131160804: DIP Switch Dimensions L x W x H: 5.6 x 2 mm Series: WS-DISV L: 6.12 mm Poles: 4; Manufacturer: Wurth Electronics; Body Material: Polyphenylene,Polyphthalamide; Mechanical Life: 2000Cycles; Contact Resistance: 50mR; Contact Current Rating: 25mA; Number of Positions: 4; Voltage Rating (DC): 24V; Electrical Life: 1000Cycles; Throw Configuration: SPST; Insulation Resistance: 100MR; Actuator Type: Slide (Standard); Pitch: 0.05inch; Washable: Yes; Supplier 1: Digi-Key; Manufacturer Part Number: 416131160804; RoHS: Yes; Category: DIP Switches; Stock 1: 13030; Pricing 1: 1=5.25000, 10=5.08200, 50=4.81400, 100=4.27900, 500=4.01200 (USD); Mount: Surface Mount; Contact Material: Copper Alloy,Gold; Contact Plating: Gold; Min Operating Temperature: -40°C; Max Operating Temperature: 85°C; Package Quantity: 1; Packaging: Cut Tape; Current Rating: 25mA; Termination: Gull Wing; Number of Circuits: 4; Max Voltage Rating (DC): 24V; Series: WS-DISV; Length: 0.241inch; Width: 5.6mm; Height: 2mm; Reach SVHC Compliant: Yes; Lead Free: Lead Free; RoHS Compliant: Yes; ComponentLink1URL: https://datasheet.ciiva.com/30467/0900766b812902d9-30467107.pdf?src-supplier=RSComponents; ComponentLink1Description: https://datasheet.ciiva.com/30467/0900766b812902d9-30467107.pdf?src-supplier=RSComponents; ComponentLink2URL: https://datasheet.ciiva.com/1528/4161311608xx-1528928.pdf?src-supplier=Element14; ComponentLink2Description: https://datasheet.ciiva.com/1528/4161311608xx-1528928.pdf?src-supplier=Element14; ComponentLink3URL: https://datasheet.ciiva.com/2863/4161311608xx-2863702.pdf?src-supplier=Digi-Key; ComponentLink3Description: https://datasheet.ciiva.com/2863/4161311608xx-2863702.pdf?src-supplier=Digi-Key; ComponentLink4URL: https://datasheet.ciiva.com/2863/4161311608xx-2863701.pdf?src-supplier=Digi-Key; ComponentLink4Description: https://datasheet.ciiva.com/2863/4161311608xx-2863701.pdf?src-supplier=Digi-Key; ComponentLink5URL: https://datasheet.ciiva.com/1625/4161311608xx-1625344.pdf?src-supplier=Farnell; ComponentLink5Description: https://datasheet.ciiva.com/1625/4161311608xx-1625344.pdf?src-supplier=Farnell
U1.3 = BME680: Pimoroni.com - Pressure, Temperature and Humidity Sensor Digital Output 1.8V 8-Pin LGA; Manufacturer: Bosch Sensortec; Output Type: SPI,I2C; Supplier 1: Future Electronics; Manufacturer Part Number: BME680; RoHS: No; Category: Uncategorized; Stock 1: 64; Pricing 1: 1=9.84000, 20=8.81000, 125=8.18000, 500=7.71000, 3000=7.09000 (USD); Min Operating Temperature: -40°C; Max Operating Temperature: 85°C; Sensor Type: Temperature; ComponentLink1URL: https://ae-bst.resource.bosch.com/media/_tech/media/application_notes/BST-BME680-HS000-05.pdf?src-supplier=Digi-Key; ComponentLink1Description: https://ae-bst.resource.bosch.com/media/_tech/media/application_notes/BST-BME680-HS000-05.pdf?src-supplier=Digi-Key; ComponentLink2URL: https://ae-bst.resource.bosch.com/media/_tech/media/product_flyer/BST-BME680-FL000.pdf?src-supplier=Digi-Key; ComponentLink2Description: https://ae-bst.resource.bosch.com/media/_tech/media/product_flyer/BST-BME680-FL000.pdf?src-supplier=Digi-Key
U2.3 = Adafruit BNO055: BNO055 Series 1.7 to 3.6 V Intelligent 9-Axis Absolute Orientation Sensor-LGA-28; Manufacturer: Bosch; Sensor Type: Accelerometer,Gyroscope,Magnetometer,3 Axis; Output Type: I2C; Supplier 1: Future Electronics; Manufacturer Part Number: BNO055; RoHS: No; Category: Inertial Measurement Units (IMUs); Pricing 1: 4000=7.70000 (USD); Mount: Surface Mount; Case/Package: LGA; Min Operating Temperature: -40°C; Max Operating Temperature: 85°C; Packaging: Tape and Reel; Lead Free: Lead Free; ComponentLink1URL: https://ae-bst.resource.bosch.com/media/_tech/media/application_notes/BST-BNO055-HS000.pdf ?src-supplier=Digi-Key; ComponentLink1Description: https://ae-bst.resource.bosch.com/media/_tech/media/application_notes/BST-BNO055-HS000.pdf ?src-supplier=Digi-Key
U3.3 = DS3231SN#: DS3231 Series 5.5 V Extremely Accurate I2C-Integrated RTC/TCXO/Crystal - SOIC-16; Manufacturer: Maxim; Logic Function: Clock; Time Format: HH:MM:SS; Max Supply Voltage: 5.5V; Min Supply Voltage: 2.3V; Operating Supply Voltage: 3.3V; Interface: I2C,Serial,2-Wire; Date Format: YY-MM-DD-dd; Number of Outputs: 1; Frequency: 32.768kHz; Supplier 1: Newark; Manufacturer Part Number: DS3231SN#; RoHS: Yes; Category: Real Time Clocks; Pricing 1: 1=11.12000, 10=10.69000, 25=10.25000, 138=9.03000, 276=8.59000, 506=8.31000 (USD); Mount: Surface Mount; Case/Package: SOIC; Number of Pins: 16; Weight: 0.023492oz; Min Operating Temperature: -40°C; Max Operating Temperature: 85°C; Package Quantity: 46; Packaging: Bulk; Series: DS3231SN; Termination: SMD/SMT; Length: 10.5mm; Width: 7.6mm; Height: 2.35mm; Radiation Hardening: No; RoHS Compliant: Yes; Lead Free: Lead Free; ComponentLink1URL: https://datasheet.ciiva.com/1139/1675711-1139210.pdf?src-supplier=Element14; ComponentLink1Description: https://datasheet.ciiva.com/1139/1675711-1139210.pdf?src-supplier=Element14; ComponentLink2URL: https://datasheet.ciiva.com/23867/45724-23867216.pdf?src-supplier=Newark; ComponentLink2Description: https://datasheet.ciiva.com/23867/45724-23867216.pdf?src-supplier=Newark; ComponentLink3URL: https://datasheet.ciiva.com/1146/ds3231-1146707.pdf?src-supplier=Newark; ComponentLink3Description: https://datasheet.ciiva.com/1146/ds3231-1146707.pdf?src-supplier=Newark; ComponentLink4URL: https://datasheet.ciiva.com/1240/ds3231-ds3231s-1240689.pdf?src-supplier=Digi-Key; ComponentLink4Description: https://datasheet.ciiva.com/1240/ds3231-ds3231s-1240689.pdf?src-supplier=Digi-Key; ComponentLink5URL: https://datasheet.ciiva.com/4772/ds3231-102175-4772091.pdf?src-supplier=Mouser; ComponentLink5Description: https://datasheet.ciiva.com/4772/ds3231-102175-4772091.pdf?src-supplier=Mouser; ComponentLink6URL: https://datasheet.ciiva.com/12291/ds3231-102175-12291423.pdf?src-supplier=Mouser; ComponentLink6Description: https://datasheet.ciiva.com/12291/ds3231-102175-12291423.pdf?src-supplier=Mouser; ComponentLink7URL: https://datasheet.ciiva.com/14244/ds3231-14244059.pdf?src-supplier=Avnet; ComponentLink7Description: https://datasheet.ciiva.com/14244/ds3231-14244059.pdf?src-supplier=Avnet
U4.3 = 74HC14D,652: Vendor: Nexperia; SourceLibrary: Nexperia_2018-05-2018; Manufacturer_Part_Number: 74HC14D,652; Copyright: Copyright (C) 2016 Accelerated Designs. All rights reserved; RefDes: RefDes; Type: DEV; Value: Value; Local Supplier: thegioiic; Local Supplier Part Number: *; Local Supplier Link: https://www.thegioiic.com/products/74hc14d
M1.3 = GY9250: Local Supplier: thegioiic; Local Supplier Part Number: *; Local Supplier Link: https://www.thegioiic.com/products/gy-9250-mach-cam-bien-9dof